# EAGLE design Etage sortie VCF (EAGLE 9.5.1)
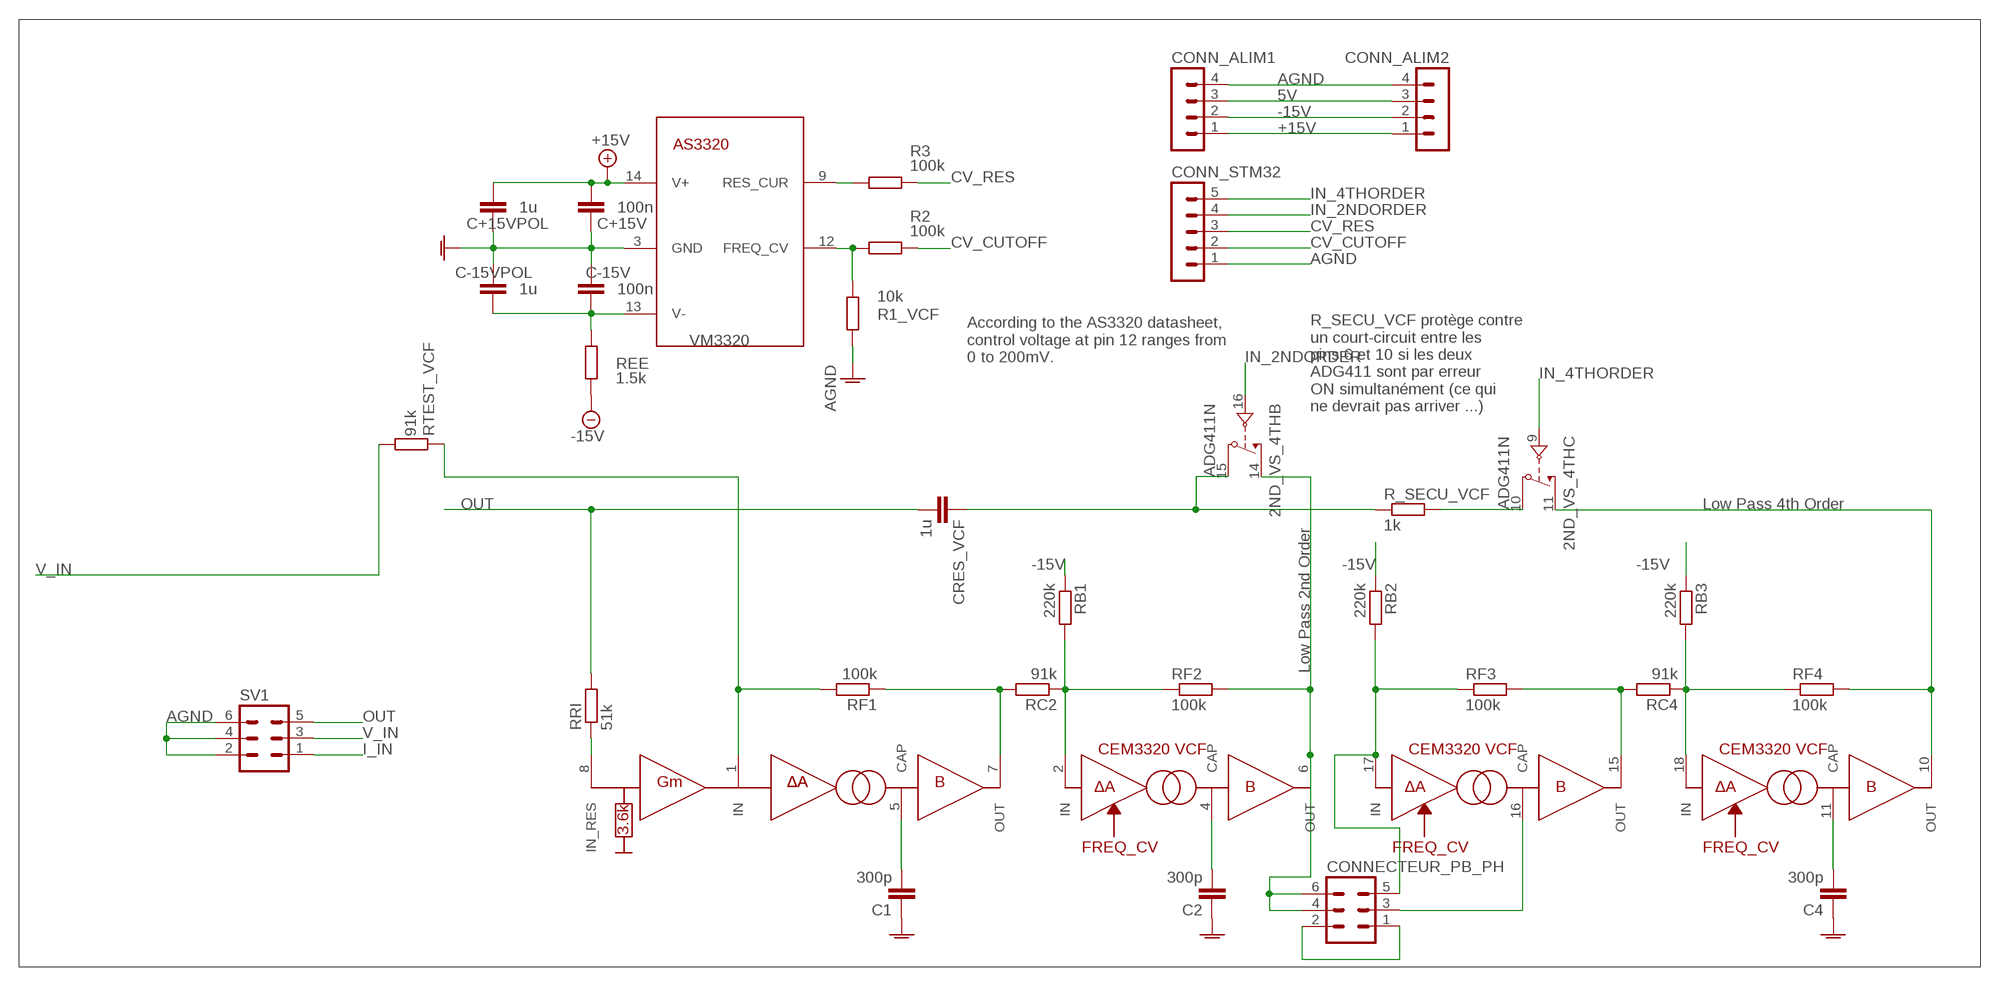
[diagram p0: schematic, sheet 1]

## Parts
2ND_VS_4TH  ADG411N  [DIL16]
C1  300p  C-EU075-032X103  [C075-032X103]
C2  300p  C-EU075-032X103  [C075-032X103]
C4  300p  C-EU075-032X103  [C075-032X103]
C+15V  100n  C-EU075-032X103  [C075-032X103]
C+15VPOL  1u  C-EU075-032X103  [C075-032X103]
C-15V  100n  C-EU075-032X103  [C075-032X103]
C-15VPOL  1u  C-EU075-032X103  [C075-032X103]
CONN_ALIM1  MA04-1  [MA04-1]
CONN_ALIM2  MA04-1  [MA04-1]
CONN_STM32  MA05-1  [MA05-1]
CONNECTEUR_PB_PH  MA03-2  [MA03-2]
CRES_VCF  1u  C-EU075-032X103  [C075-032X103]
R1_VCF  10k  R-EU_0204/7  [0204/7]
R2  100k  R-EU_0204/7  [0204/7]
R3  100k  R-EU_0204/7  [0204/7]
R_SECU_VCF  1k  R-EU_0204/7  [0204/7]
RB1  220k  R-EU_0207/10  [0207/10]
RB2  220k  R-EU_0204/7  [0204/7]
RB3  220k  R-EU_0204/7  [0204/7]
RC2  91k  R-EU_0204/7  [0204/7]
RC4  91k  R-EU_0204/7  [0204/7]
REE  1.5k  R-EU_0207/10  [0207/10]
RF1  100k  R-EU_0207/10  [0207/10]
RF2  100k  R-EU_0204/7  [0204/7]
RF3  100k  R-EU_0207/10  [0207/10]
RF4  100k  R-EU_0204/7  [0204/7]
RRI  51k  R-EU_0207/10  [0207/10]
RTEST_VCF  91k  R-EU_0207/10  [0207/10]
SV1  MA03-2  [MA03-2]
VCF  AS3320  [DIL18]

## Nets
5V: CONN_ALIM1.3 CONN_ALIM2.3
+15V: C+15V.2 C+15VPOL.2 CONN_ALIM1.1 CONN_ALIM2.1 VCF.14(POW$1:V+)
-15V: CONN_ALIM1.2 CONN_ALIM2.2 RB1.1 RB2.1 RB3.1 REE.1
AGND: C1.1 C2.1 C4.1 C+15V.1 C+15VPOL.1 C-15V.2 C-15VPOL.2 CONN_ALIM1.4 CONN_ALIM2.4 CONN_STM32.1 R1_VCF.2 SV1.2 SV1.4 SV1.6 VCF.3(POW$1:GND)
CV_CUTOFF: CONN_STM32.2 R2.2
CV_RES: CONN_STM32.3 R3.2
I_IN: SV1.1
IN_2NDORDER: 2ND_VS_4TH.16(B:IN) CONN_STM32.4
IN_4THORDER: 2ND_VS_4TH.9(C:IN) CONN_STM32.5
N$2: CONNECTEUR_PB_PH.3 VCF.16(OTA$4:CAP)
N$3: CONNECTEUR_PB_PH.1 CONNECTEUR_PB_PH.2
N$5: C1.2 VCF.5(OTA$1:CAP)
N$18: C2.2 VCF.4(OTA$2:CAP)
N$24: C4.2 VCF.11(OTA$3:CAP)
N$37: R1_VCF.1 R2.1 VCF.12(POW$1:FREQ_CV)
N$57: RC2.2 RF1.1 VCF.7(OTA$1:OUT)
N$58: 2ND_VS_4TH.15(B:D) CRES_VCF.1 R_SECU_VCF.1
N$62: RB1.2 RC2.1 RF2.1 VCF.2(OTA$2:IN)
N$65: 2ND_VS_4TH.14(B:S) CONNECTEUR_PB_PH.4 CONNECTEUR_PB_PH.6 RF2.2 VCF.6(OTA$2:OUT)
N$69: 2ND_VS_4TH.11(C:S) RF4.2 VCF.10(OTA$3:OUT)
N$72: CONNECTEUR_PB_PH.5 RB2.2 RF3.1 VCF.17(OTA$4:IN)
N$73: 2ND_VS_4TH.10(C:D) R_SECU_VCF.2
N$82: RC4.2 RF3.2 VCF.15(OTA$4:OUT)
N$83: RB3.2 RC4.1 RF4.1 VCF.18(OTA$3:IN)
N$86: RRI.1 VCF.8(OTA$1:IN_RES)
N$87: R3.1 VCF.9(POW$1:RES_CUR)
OUT: CRES_VCF.2 RRI.2 SV1.5
V_IN: RTEST_VCF.1 SV1.3
VCF_IN: RF1.2 RTEST_VCF.2 VCF.1(OTA$1:IN)
VM3320: C-15V.1 C-15VPOL.1 REE.2 VCF.13(POW$1:V-)
Unconnected: 2ND_VS_4TH.1(A:IN) 2ND_VS_4TH.2(A:D) 2ND_VS_4TH.3(A:S) 2ND_VS_4TH.6(D:S) 2ND_VS_4TH.7(D:D) 2ND_VS_4TH.8(D:IN)

## Notes on the sheet
- According to the AS3320 datasheet, 
  control voltage at pin 12 ranges from
  0 to 200mV.
- R_SECU_VCF protège contre 
  un court-circuit entre les 
  pins 6 et 10 si les deux 
  ADG411 sont par erreur 
  ON simultanément (ce qui 
  ne devrait pas arriver ...)
- Low Pass 4th Order
- Low Pass 2nd Order

## Power pins joined to a net without a drawn wire
GND: 2ND_VS_4TH.5(P:GND)
VDD: 2ND_VS_4TH.13(P:VDD)
VL: 2ND_VS_4TH.12(P:VL)
VSS: 2ND_VS_4TH.4(P:VSS)

## Library data of the parts
2ND_VS_4TH = analog-devices:ADG411: LC2MOS Precision Quad SPST Switches Source: http://www.analog.com/static/imported-files/data_sheets/ADG411_412_413.pdf; MF: ALTERA CORPORATION; MPN: ADG411BN; OC_FARNELL: 1424317; OC_NEWARK: 05F6198
C1 C2 C4 C+15V C+15VPOL C-15V C-15VPOL CRES_VCF = rcl:C-EU: CAPACITOR, European symbol; SPICEPREFIX: C
CONN_ALIM1 CONN_ALIM2 = con-lstb:MA04-1: PIN HEADER; OC_FARNELL: unknown; OC_NEWARK: unknown
CONN_STM32 = con-lstb:MA05-1: PIN HEADER; OC_FARNELL: unknown; OC_NEWARK: unknown
CONNECTEUR_PB_PH SV1 = con-lstb:MA03-2: PIN HEADER; OC_FARNELL: unknown; OC_NEWARK: unknown
R1_VCF R2 R3 R_SECU_VCF RB1-RB3 RC2 RC4 REE RF1-RF4 RRI RTEST_VCF = rcl:R-EU_: RESISTOR, European symbol; SPICEPREFIX: R
VCF = analog-audio-chips:AS3320: Voltage Controlled Filter capable of 4th order LP, BP or HP designed by famous audio chips designer Curtis Electronics.

## Board
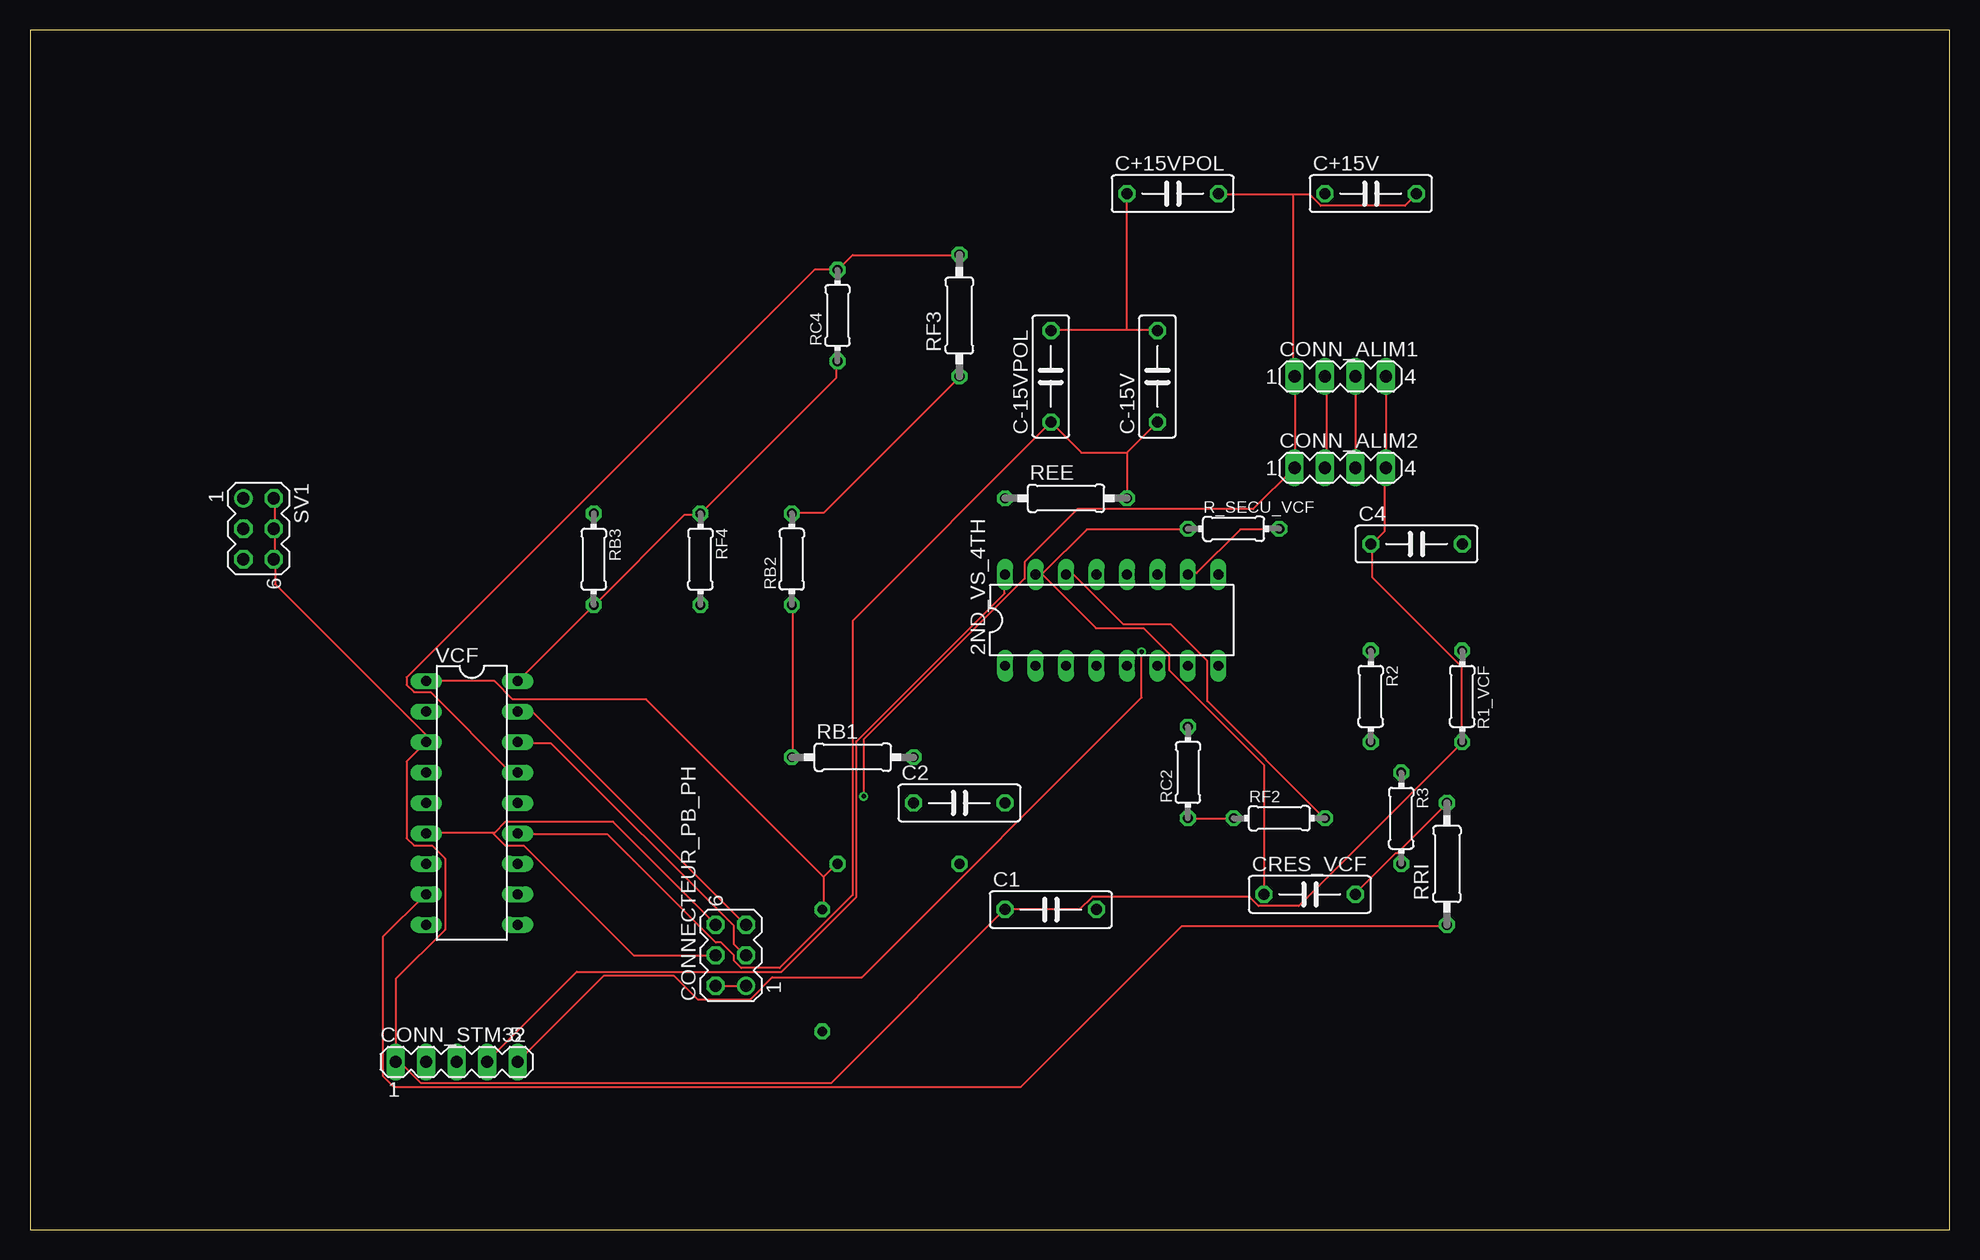
[diagram p1: board, top side]
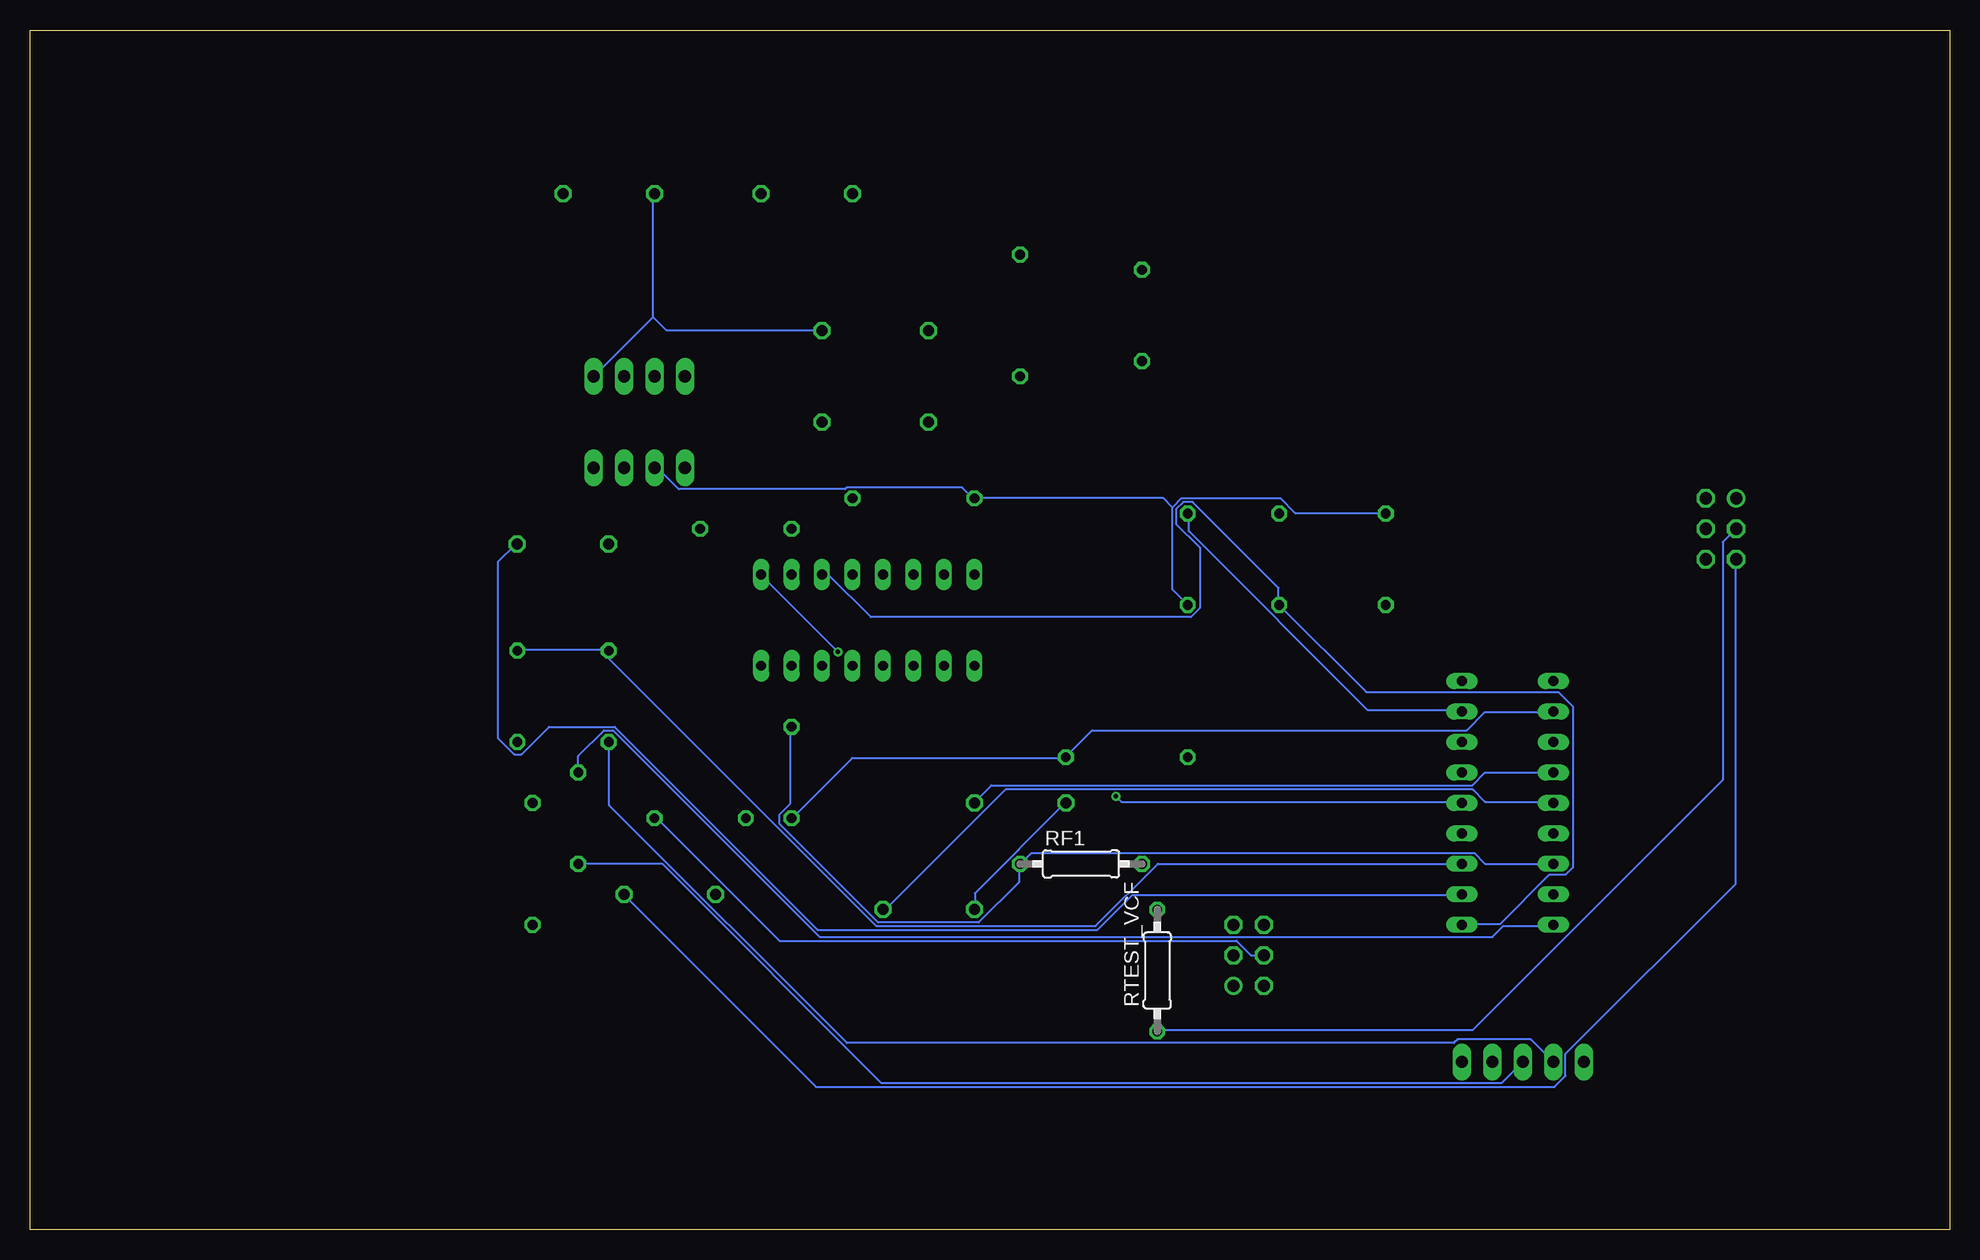
[diagram p2: board, bottom side, seen from below]

Size 160 x 100 mm. Coordinates in mm from the lower left corner, seen from the top.
Outline: 0,0 160,0 160,100 0,100 0,0
Copper layers (1*16): Top 0.035mm / dielectric 1.5mm / Bottom 0.035mm
Design rules "default": minimum track width 6mil, minimum drill 0.35mm, track to track 6mil, track to pad 6mil, pad to pad 6mil, via to via 6mil, smd to smd 6mil, copper to edge 40mil, drill to drill 6mil, minimum pad ring 10mil, minimum via ring 8mil, stop-mask expansion 4mil, vias tented up to drill 0mil, thermal gap 10mil

### Footprints (pad centres in the part's own frame; a part is rotated, then mirrored left to right if it is on the bottom)
DIL16 = drill 0.813 long: 1 -8.89,-3.81; 2 -6.35,-3.81; 3 -3.81,-3.81; 4 -1.27,-3.81; 5 1.27,-3.81; 6 3.81,-3.81; 7 6.35,-3.81; 8 8.89,-3.81; 9 8.89,3.81; 10 6.35,3.81; 11 3.81,3.81; 12 1.27,3.81; 13 -1.27,3.81; 14 -3.81,3.81; 15 -6.35,3.81; 16 -8.89,3.81
C075-032X103 = drill 0.914 octagon: 1 -3.81,0; 2 3.81,0
MA04-1 = drill 1.016 long: 1 -3.81,0; 2 -1.27,0; 3 1.27,0; 4 3.81,0
MA05-1 = drill 1.016 long: 1 -5.08,0; 2 -2.54,0; 3 0,0; 4 2.54,0; 5 5.08,0
MA03-2 = drill 1.016: 1 -2.54,-1.27 | drill 1.016 octagon: 2 -2.54,1.27; 3 0,-1.27; 4 0,1.27; 5 2.54,-1.27; 6 2.54,1.27
0204/7 = drill 0.813 octagon: 1 -3.81,0; 2 3.81,0
0207/10 = drill 0.813 octagon: 1 -5.08,0; 2 5.08,0
DIL18 = drill 0.813 long: 1 -10.16,-3.81; 2 -7.62,-3.81; 3 -5.08,-3.81; 4 -2.54,-3.81; 5 0,-3.81; 6 2.54,-3.81; 7 5.08,-3.81; 8 7.62,-3.81; 9 10.16,-3.81; 10 10.16,3.81; 11 7.62,3.81; 12 5.08,3.81; 13 2.54,3.81; 14 0,3.81; 15 -2.54,3.81; 16 -5.08,3.81; 17 -7.62,3.81; 18 -10.16,3.81

### Placement (x,y rotation side)
2ND_VS_4TH  90.17,50.8 0 top
C1  85.09,26.67 0 top
C2  77.47,35.56 0 top
C4  115.57,57.15 0 top
C+15V  111.76,86.36 0 top
C+15VPOL  95.25,86.36 0 top
C-15V  93.98,71.12 90 top
C-15VPOL  85.09,71.12 90 top
CONN_ALIM1  109.22,71.12 0 top
CONN_ALIM2  109.22,63.5 0 top
CONN_STM32  35.56,13.97 0 top
CONNECTEUR_PB_PH  58.42,22.86 90 top
CRES_VCF  106.68,27.94 0 top
R1_VCF  119.38,44.45 270 top
R2  111.76,44.45 270 top
R3  114.3,34.29 270 top
R_SECU_VCF  100.33,58.42 0 top
RB1  68.58,39.37 0 top
RB2  63.5,55.88 90 top
RB3  46.99,55.88 270 top
RC2  96.52,38.1 90 top
RC4  67.31,76.2 90 top
REE  86.36,60.96 0 top
RF1  72.39,30.48 0 bottom
RF2  104.14,34.29 0 top
RF3  77.47,76.2 90 top
RF4  55.88,55.88 270 top
RRI  118.11,30.48 90 top
RTEST_VCF  66.04,21.59 90 bottom
SV1  19.05,58.42 270 top
VCF  36.83,35.56 270 top

### Tracks (layer width: path | path; a pad name or v marks a point on that pad's centre or on a via)
5V
  Top 0.152: CONN_ALIM1.3 CONN_ALIM2.3
+15V  (via drill 0.35)
  Top 0.152: 105.31,86.26 106.68,86.26 107.59,85.34 114.61,85.34 115.52,86.26 C+15V.2 | 105.31,86.26 99.06,86.26 C+15VPOL.2 | v69.49,36.12 69.49,40.84 82.91,54.25 82.91,55.63 87.33,60.05 101.96,60.05 CONN_ALIM2.1 105.46,63.55 105.46,71.02 CONN_ALIM1.1 105.31,71.17 105.31,86.26
  Bottom 0.152: v69.49,36.12 69.04,35.66 40.69,35.66 VCF.14
-15V
  Top 0.152: CONN_ALIM2.2 108.05,63.55 108.05,71.02 CONN_ALIM1.2 | RB1.1 63.55,39.47 63.55,51.97 RB2.1
  Bottom 0.152: 64.77,60.2 64.01,60.96 55.78,60.96 54.56,59.74 47.09,59.74 RB3.1 | 64.77,60.2 64.77,53.34 RB2.1 | 64.77,60.2 65.53,60.96 REE.1 81.38,60.96 82.3,61.87 91.9,61.87 92.05,61.72 105.92,61.72 107.59,63.4 107.9,63.4 CONN_ALIM2.2
AGND
  Top 0.152: SV1.2 20.42,60.96 20.42,58.52 SV1.4 20.42,58.37 20.42,55.93 SV1.6 20.42,55.78 20.42,53.8 32.92,41.3 32.92,40.69 VCF.3 31.39,39.01 31.39,32.61 32,32 33.53,32 34.59,30.94 34.59,24.99 30.48,20.88 CONN_STM32.1 30.48,13.87 30.94,13.87 32.61,12.19 66.75,12.19 81.23,26.67 C1.1 87.48,26.67 88.54,27.74 101.65,27.74 102.41,26.98 105.77,26.98 119.33,40.54 R1_VCF.2 119.33,40.69 119.33,46.94 111.86,54.41 111.86,57.15 | 91.44,74.98 93.88,74.98 C-15V.2 | 91.44,74.98 85.19,74.98 C-15VPOL.2 | 91.44,74.98 C+15VPOL.1 | 111.86,57.15 112.93,58.22 112.93,63.4 CONN_ALIM2.4 113.08,63.55 113.08,71.02 CONN_ALIM1.4 | 111.86,57.15 C4.1
  Bottom 0.152: 108.05,76.05 108.05,86.26 C+15V.1 | 108.05,76.05 112.93,71.17 CONN_ALIM1.4 | 108.05,76.05 106.98,74.98 94.03,74.98 C-15V.2 | C1.1 81.23,26.67 81.23,28.04 73.76,35.51 C2.1
CV_CUTOFF
  Bottom 0.152: CONN_STM32.2 34.9,15.85 41,15.85 41.3,15.54 91.9,15.54 111.71,35.36 111.71,40.54 R2.2
CV_RES
  Bottom 0.152: R3.2 107.29,30.48 89,12.19 37.34,12.19 CONN_STM32.3
IN_2NDORDER
  Top 0.152: 2ND_VS_4TH.16 81.23,54.56 81.23,53.03 68.89,40.69 68.89,27.74 62.64,21.49 45.57,21.49 38.1,14.02 CONN_STM32.4
IN_4THORDER  (via drill 0.35)
  Top 0.152: v92.66,48.16 92.66,44.35 69.34,21.03 61.87,21.03 60.05,19.2 55.63,19.2 53.65,21.18 47.85,21.18 CONN_STM32.5
  Bottom 0.152: v92.66,48.16 99.06,54.56 2ND_VS_4TH.9
N$2
  Top 0.152: VCF.16 40.69,40.54 43.43,40.54 58.67,25.3 58.67,23.77 59.59,22.86 CONNECTEUR_PB_PH.3
N$3
  Top 0.152: CONNECTEUR_PB_PH.2 57.15,20.27 59.59,20.27 CONNECTEUR_PB_PH.1
N$5
  Bottom 0.152: C1.2 88.7,26.67 78.64,36.73 39.78,36.73 38.71,35.66 33.07,35.66 VCF.5
N$18
  Bottom 0.152: VCF.4 38.71,38.1 39.78,37.03 79.86,37.03 81.23,35.66 C2.2
N$24
  Bottom 0.152: VCF.11 40.69,27.89 68.12,27.89 71.02,24.99 94.34,24.99 111.25,41.91 116.74,41.91 119.02,39.62 119.63,39.62 121.01,41 121.01,55.63 119.48,57.15 C4.2
N$37
  Bottom 0.152: VCF.12 65.99,30.48 71.17,25.3 89.46,25.3 111.71,47.55 111.71,48.16 R2.1 111.86,48.31 119.33,48.31 R1_VCF.1
N$57
  Bottom 0.152: VCF.7 38.71,30.48 39.62,31.39 76.5,31.39 77.42,30.48 RF1.1 77.57,30.48 77.57,28.96 80.92,25.6 89.31,25.6 97.54,33.83 97.54,34.59 96.62,35.51 96.62,41.91 RC2.2
N$58
  Top 0.152: 84.28,54.71 84.43,54.71 88.09,58.37 96.47,58.37 R_SECU_VCF.1 | 84.28,54.71 83.82,54.71 2ND_VS_4TH.15 84.28,54.71 | CRES_VCF.1 102.87,38.71 94.94,46.63 94.94,48.01 92.81,50.14 88.85,50.14 84.28,54.71
N$62
  Top 0.152: RC2.1 RF2.1
  Bottom 0.152: RC2.1 96.47,34.29 91.44,39.32 73.76,39.32 RB1.2 73.61,39.47 71.48,41.6 40.23,41.6 38.71,43.13 33.07,43.13 VCF.2
N$65
  Top 0.152: 38.56,33.07 38.71,33.07 39.62,33.98 48.62,33.98 57.15,25.45 CONNECTEUR_PB_PH.6 | 38.56,33.07 33.07,33.07 VCF.6 | CONNECTEUR_PB_PH.4 50.29,22.86 41.15,32 39.62,32 38.56,33.07 | 2ND_VS_4TH.14 86.41,54.56 87.02,54.56 91.14,50.44 95.1,50.44 98.15,47.4 98.15,44.04 107.9,34.29 RF2.2
  Bottom 0.152: CONNECTEUR_PB_PH.4 58.22,22.86 59.44,24.08 97.54,24.08 107.75,34.29 RF2.2
N$69
  Bottom 0.152: VCF.10 40.54,25.45 37.49,25.45 33.38,29.57 32,29.57 31.39,30.18 31.39,43.59 32.61,44.81 48.62,44.81 RF4.2 55.93,52.12 55.93,53.49 63.09,60.66 63.86,60.66 64.47,60.05 64.47,58.83 62.48,56.84 62.48,51.82 63.25,51.05 89.92,51.05 93.42,54.56 93.88,54.56 2ND_VS_4TH.11
N$72
  Top 0.152: RB2.2 63.55,59.74 66.14,59.74 77.42,71.02 RF3.1 | VCF.17 40.69,43.13 41.91,43.13 59.59,25.45 CONNECTEUR_PB_PH.5
  Bottom 0.152: RB2.2 63.4,59.59 63.4,58.22 48.46,43.28 40.69,43.28 VCF.17
N$73
  Top 0.152: 2ND_VS_4TH.10 96.62,54.71 97.23,54.71 100.89,58.37 104.09,58.37 R_SECU_VCF.2
N$82
  Top 0.152: VCF.15 40.08,38.1 33.38,44.81 32,44.81 31.39,45.41 31.39,46.02 65.38,80.01 RC4.2 67.36,80.01 68.58,81.23 77.42,81.23 RF3.2
N$83
  Top 0.152: VCF.18 40.69,45.72 46.94,51.97 RB3.2 47.09,52.12 54.56,59.59 55.78,59.59 RF4.1 67.21,71.02 67.21,72.39 RC4.1
N$86
  Top 0.152: RRI.1 118.11,25.3 96.01,25.3 82.6,11.89 30.33,11.89 29.41,12.8 29.41,24.38 32.92,27.89 VCF.8
N$87
  Bottom 0.152: R3.1 114.3,39.47 112.17,41.6 111.4,41.6 94.18,24.38 38.1,24.38 37.19,25.3 33.07,25.3 VCF.9
OUT
  Top 0.152: RRI.2 118.11,35.51 114,31.39 113.84,31.39 110.49,28.04 CRES_VCF.2
  Bottom 0.152: SV1.5 17.83,55.78 17.83,28.8 32,14.63 32,12.8 32.92,11.89 94.49,11.89 110.49,27.89 CRES_VCF.2
V_IN
  Bottom 0.152: SV1.3 18.9,57.3 18.9,37.49 39.78,16.61 65.99,16.61 RTEST_VCF.1
VCF_IN
  Top 0.152: 66.14,29.41 66.14,26.67 RTEST_VCF.2 | 66.14,29.41 67.21,30.48 RF1.2 | VCF.1 38.71,45.72 40.23,44.2 51.36,44.2 66.14,29.41
VM3320
  Top 0.152: 91.44,64.77 REE.2 | C-15V.1 91.44,64.77 | VCF.13 40.69,32.92 48.16,32.92 57.15,23.93 57.61,23.93 58.67,22.86 58.67,22.4 59.28,21.79 62.48,21.79 68.58,27.89 68.58,50.75 85.04,67.21 C-15VPOL.1 87.63,64.77 91.44,64.77